# Altium schematic sheet device-brake-light.SchDoc
size 297 x 209 mm
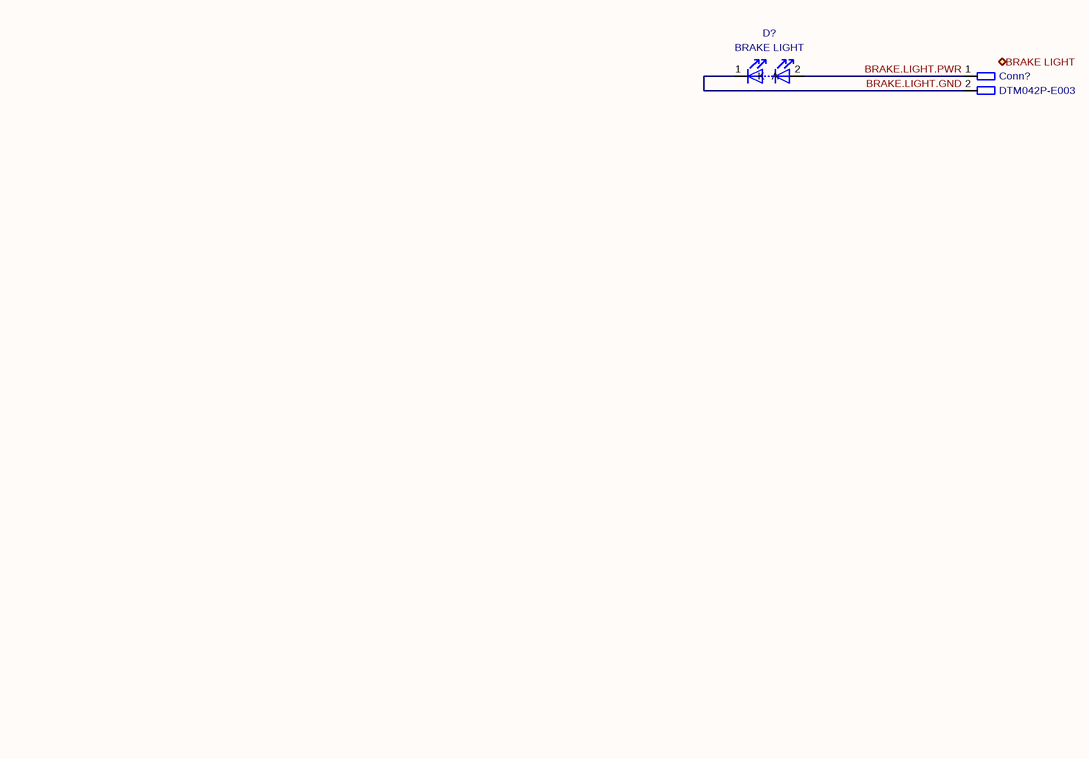
[diagram p0: device-brake-light.SchDoc]

## Parts
Conn?  P/N: DTM042P-E003  (hidden comment: Deutsch_DTM_2P_Pin)
D?  BRAKE LIGHT

## Ports
BRAKE LIGHT (bidir)

## Nets
BRAKE.LIGHT.GND: Conn?.2 D?.1(K)
BRAKE.LIGHT.PWR: Conn?.1 D?.2(A)

## Notes on the sheet
- 1
- 2
- 3
- 4
- 5
- 6
- A
- B
- C
- D
- Title: LOOM - BRAKE LIGHT
- File: device-brake-light.kicad_sch
- Sheet: /
- KiCad E.D.A.  kicad (5.1.4)-1
- Size: A4
- Date:
- Rev:
- Id: 1/1

## Library data of the parts
D? = LED_Series: Value: BRAKE LIGHT
Conn? = Deutsch_DTM_2P_Pin: Value: Deutsch_DTM_2P_Pin